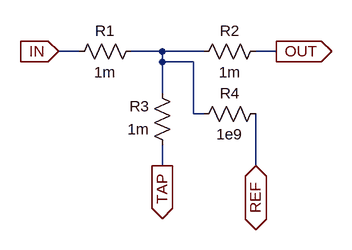
[diagram p0: schematic GenericTee.asc]
GenericTee.asc, the LTspice schematic file:
Version 4
SHEET 1 880 680
WIRE 64 144 32 144
WIRE 192 144 144 144
WIRE 256 144 192 144
WIRE 368 144 336 144
WIRE 192 160 192 144
WIRE 240 160 192 160
WIRE 192 208 192 160
WIRE 240 240 240 160
WIRE 256 240 240 240
WIRE 192 320 192 288
WIRE 336 320 336 240
FLAG 32 144 IN
IOPIN 32 144 In
FLAG 368 144 OUT
IOPIN 368 144 Out
FLAG 192 320 TAP
IOPIN 192 320 Out
FLAG 336 320 REF
IOPIN 336 320 BiDir
SYMBOL res 160 128 R90
WINDOW 0 0 56 VBottom 2
WINDOW 3 32 56 VTop 2
SYMATTR InstName R1
SYMATTR Value 1m
SYMBOL res 352 128 R90
WINDOW 0 0 56 VBottom 2
WINDOW 3 32 56 VTop 2
SYMATTR InstName R2
SYMATTR Value 1m
SYMBOL res 208 304 R180
WINDOW 0 36 76 Left 2
WINDOW 3 36 40 Left 2
SYMATTR InstName R3
SYMATTR Value 1m
SYMBOL res 352 224 R90
WINDOW 0 0 56 VBottom 2
WINDOW 3 32 56 VTop 2
SYMATTR InstName R4
SYMATTR Value 1e9

The netlist it stands for:
* GenericTee.asc
R1 N001 IN 1m
R2 OUT N001 1m
R3 TAP N001 1m
R4 REF N001 1e9
.backanno
.end